# Altium schematic sheet L1S1.SchDoc
size A4
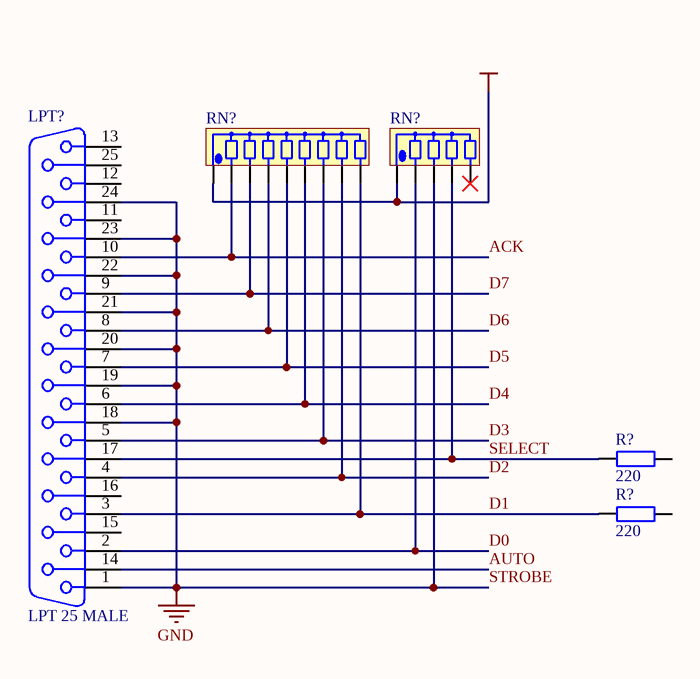
[diagram p0: L1S1.SchDoc]

## Parts
(Parts that share a designator on the sheet are numbered #1, #2 ... from top to bottom, then left to right.)
LPT?  LPT 25 MALE  [DSB 25-F]
R?#1  220  [SM-1206]
R?#2  220  [SM-1206]
RN?#1  (no value)  [RN8]
RN?#2  (no value)  [RN4]

## Nets
NetRN?#1_1: RN?#1.1 RN?#2.1
STROBE: LPT?.1 LPT?.18 LPT?.19 LPT?.20 LPT?.21 LPT?.22 LPT?.23 LPT?.24 RN?#2.3  [also labelled GND]
ACK: LPT?.10 RN?#1.2
AUTO: LPT?.14
D0: LPT?.2 RN?#2.2
D1: LPT?.3 R?#2.1 RN?#1.9
D2: LPT?.4 RN?#1.8
D3: LPT?.5 RN?#1.7
D4: LPT?.6 RN?#1.6
D5: LPT?.7 RN?#1.5
D6: LPT?.8 RN?#1.4
D7: LPT?.9 RN?#1.3
SELECT: LPT?.17 R?#1.1 RN?#2.4

Not connected (* = marked no-connect by the designer): LPT? 11 12 13 15 16 25; R?#1 2; R?#2 2; RN?#2 5*

## Library data of the parts
LPT? = DSB 25: LPT 25; PackageDocument: U; Positions: 25; Gender: Receptacle; Value: LPT 25; Published: 15-Jun-2001; LatestRevisionDate: 17-Jul-2002; LatestRevisionNote: Re-released for DXP Platform.; DatasheetDocument: 19-Mar-1999; PackageReference: 787202; Publisher: Altium Limited; Orientation: Right Angle
R?#1 R?#2 = RM: Resistor SMD; Value: 1K
RN?#1 = RN8: Resistor 8 (Thanh); Value: Tro thanh 10K
RN?#2 = RN4: Resistor 4 (thanh); Value: Tro thanh 4K7